# EAGLE design PIRT1280A1-12-breakout (EAGLE 9.6.1)

## Sheet 1 of 2: PIRT Sensor Breakout Pins
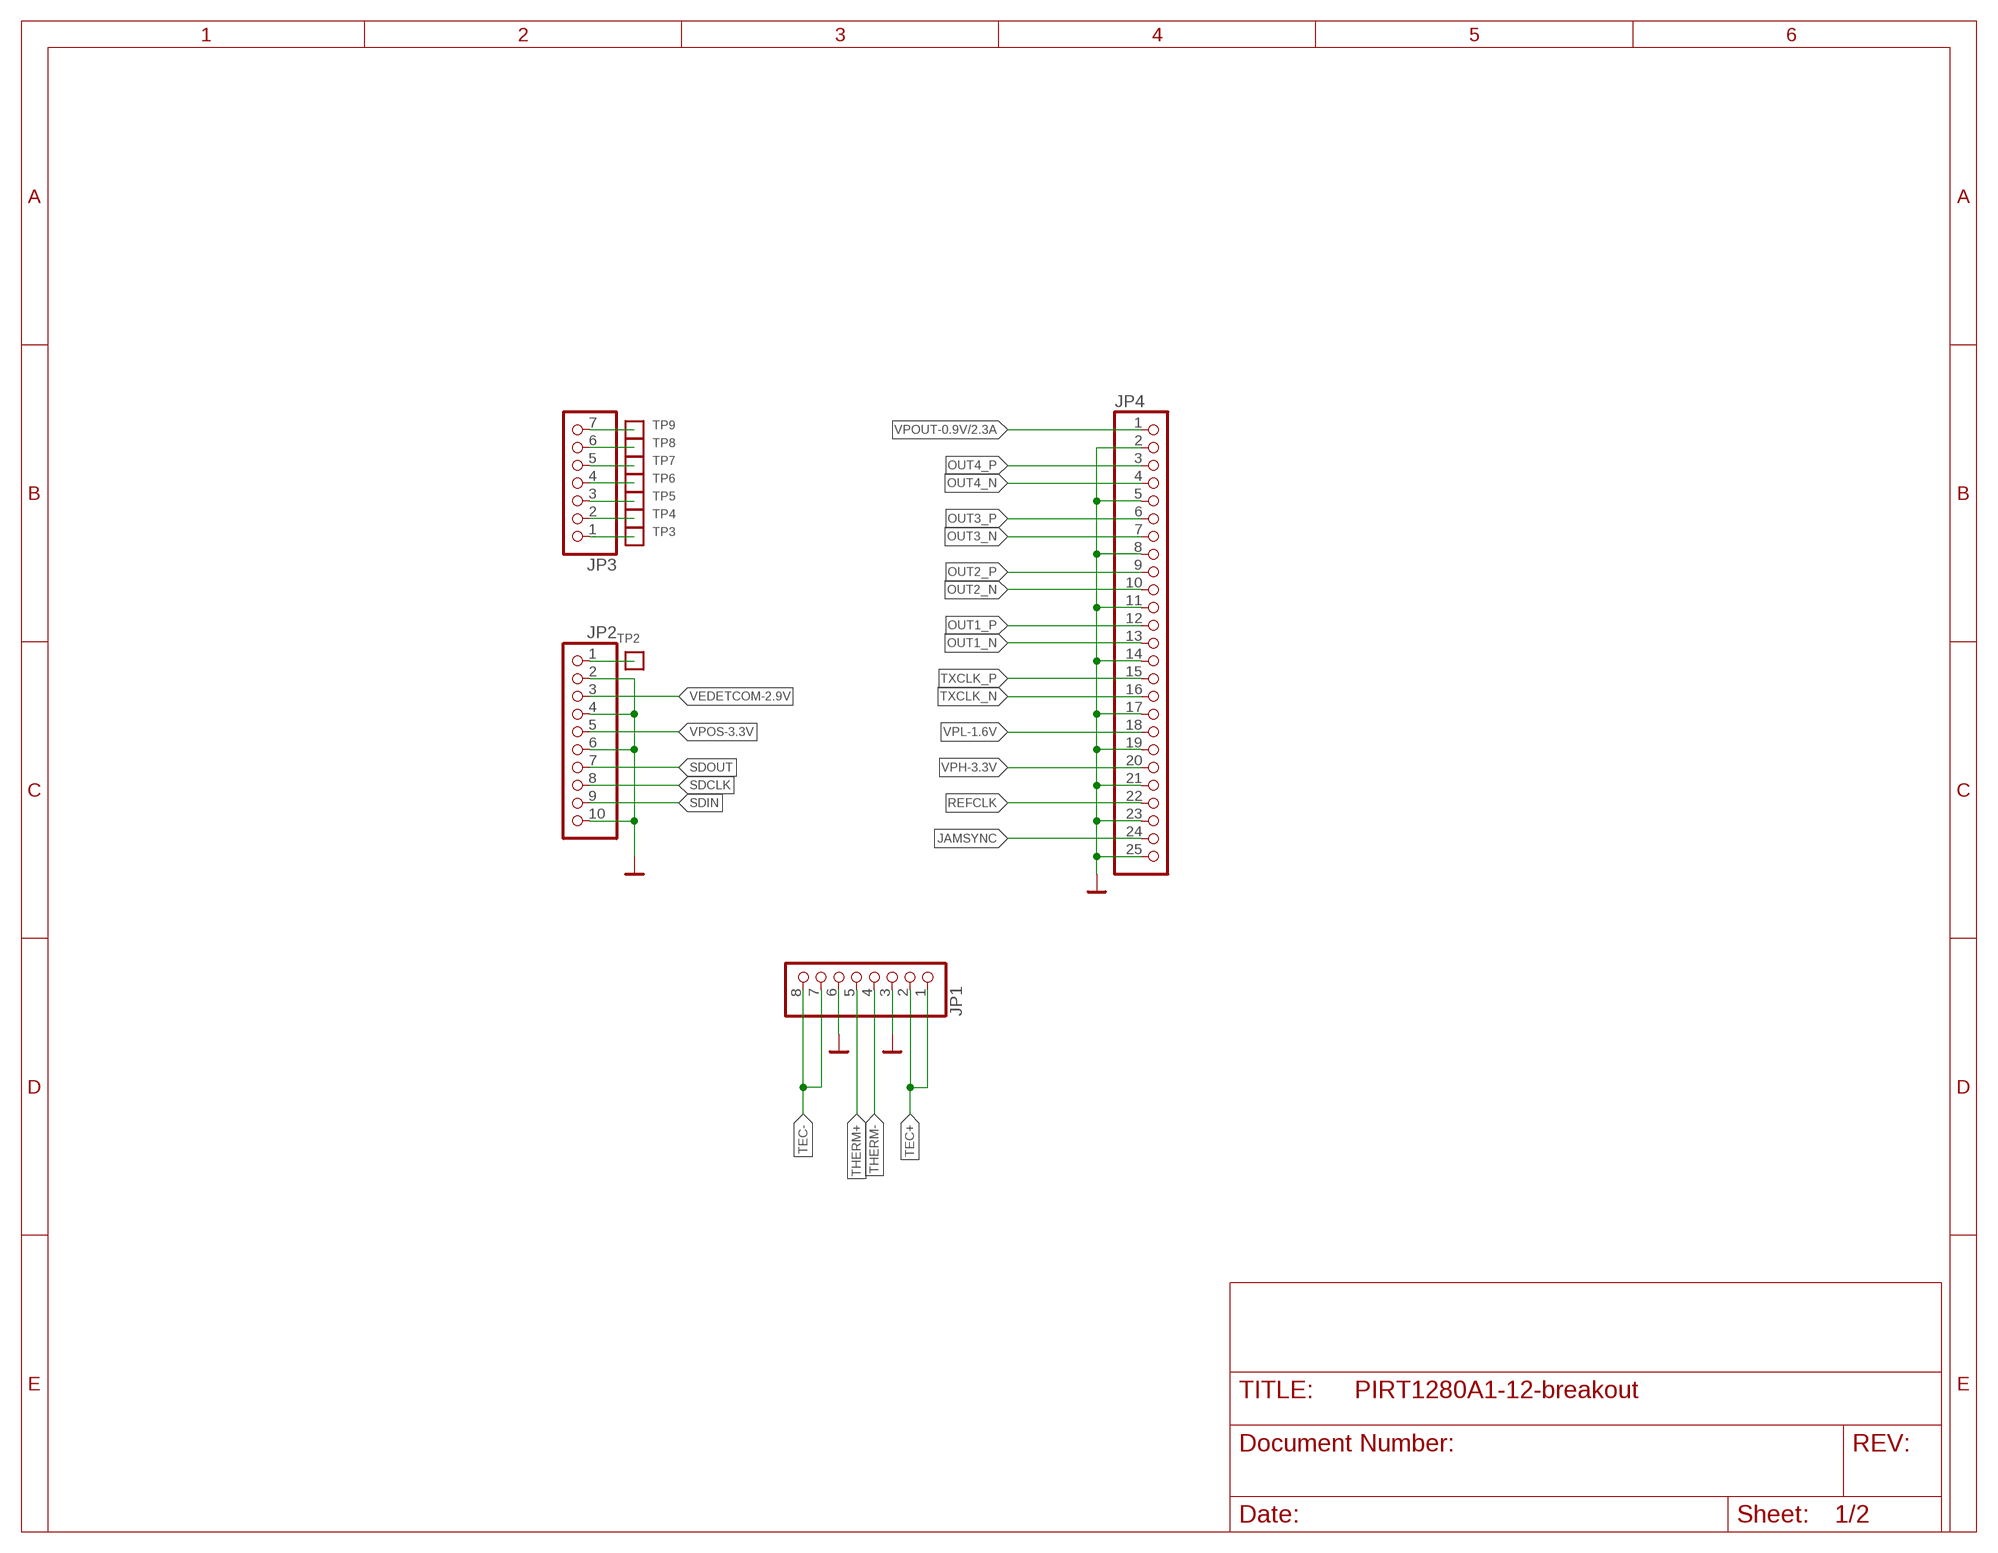
[diagram p0: schematic, sheet 1]

### Parts
JP1  PINHD-1X8  [1X08]
JP2  PINHD-1X10  [1X10]
JP3  PINHD-1X7  [1X07]
JP4  PINHD-1X25  [1X25]
TP2  TEST-POINT-LARGE-SQUARE  [1X01]
TP3  TEST-POINT-LARGE-SQUARE  [1X01]
TP4  TEST-POINT-LARGE-SQUARE  [1X01]
TP5  TEST-POINT-LARGE-SQUARE  [1X01]
TP6  TEST-POINT-LARGE-SQUARE  [1X01]
TP7  TEST-POINT-LARGE-SQUARE  [1X01]
TP8  TEST-POINT-LARGE-SQUARE  [1X01]
TP9  TEST-POINT-LARGE-SQUARE  [1X01]

### Nets
GND: JP1.3 JP1.6 JP2.2 JP2.4 JP2.6 JP2.10 JP4.2 JP4.5 JP4.8 JP4.11 JP4.14 JP4.17 JP4.19 JP4.21 JP4.23 JP4.25 ; also sheet 2
JAMSYNC: JP4.24
N$1: JP2.1 TP2.1
N$2: JP3.7 TP9.1
N$3: JP3.6 TP8.1
N$4: JP3.5 TP7.1
N$5: JP3.4 TP6.1
N$6: JP3.3 TP5.1
N$7: JP3.2 TP4.1
N$8: JP3.1 TP3.1
OUT1_N [diff-pair]: JP4.13
OUT1_P [diff-pair]: JP4.12
OUT2_N [diff-pair]: JP4.10
OUT2_P [diff-pair]: JP4.9
OUT3_N [diff-pair]: JP4.7
OUT3_P [diff-pair]: JP4.6
OUT4_N [diff-pair]: JP4.4
OUT4_P [diff-pair]: JP4.3
REFCLK: JP4.22
SDCLK: JP2.8
SDIN: JP2.9
SDOUT: JP2.7
TEC+: JP1.1 JP1.2
TEC-: JP1.7 JP1.8
THERM+: JP1.5
THERM-: JP1.4
TXCLK_N [diff-pair]: JP4.16
TXCLK_P [diff-pair]: JP4.15
VEDETCOM-2.9V: JP2.3
VPH-3.3V: JP4.20
VPL-1.6V: JP4.18
VPOS-3.3V: JP2.5
VPOUT-0.9V: JP4.1 ; also sheet 2

## Sheet 2 of 2: Power Supply
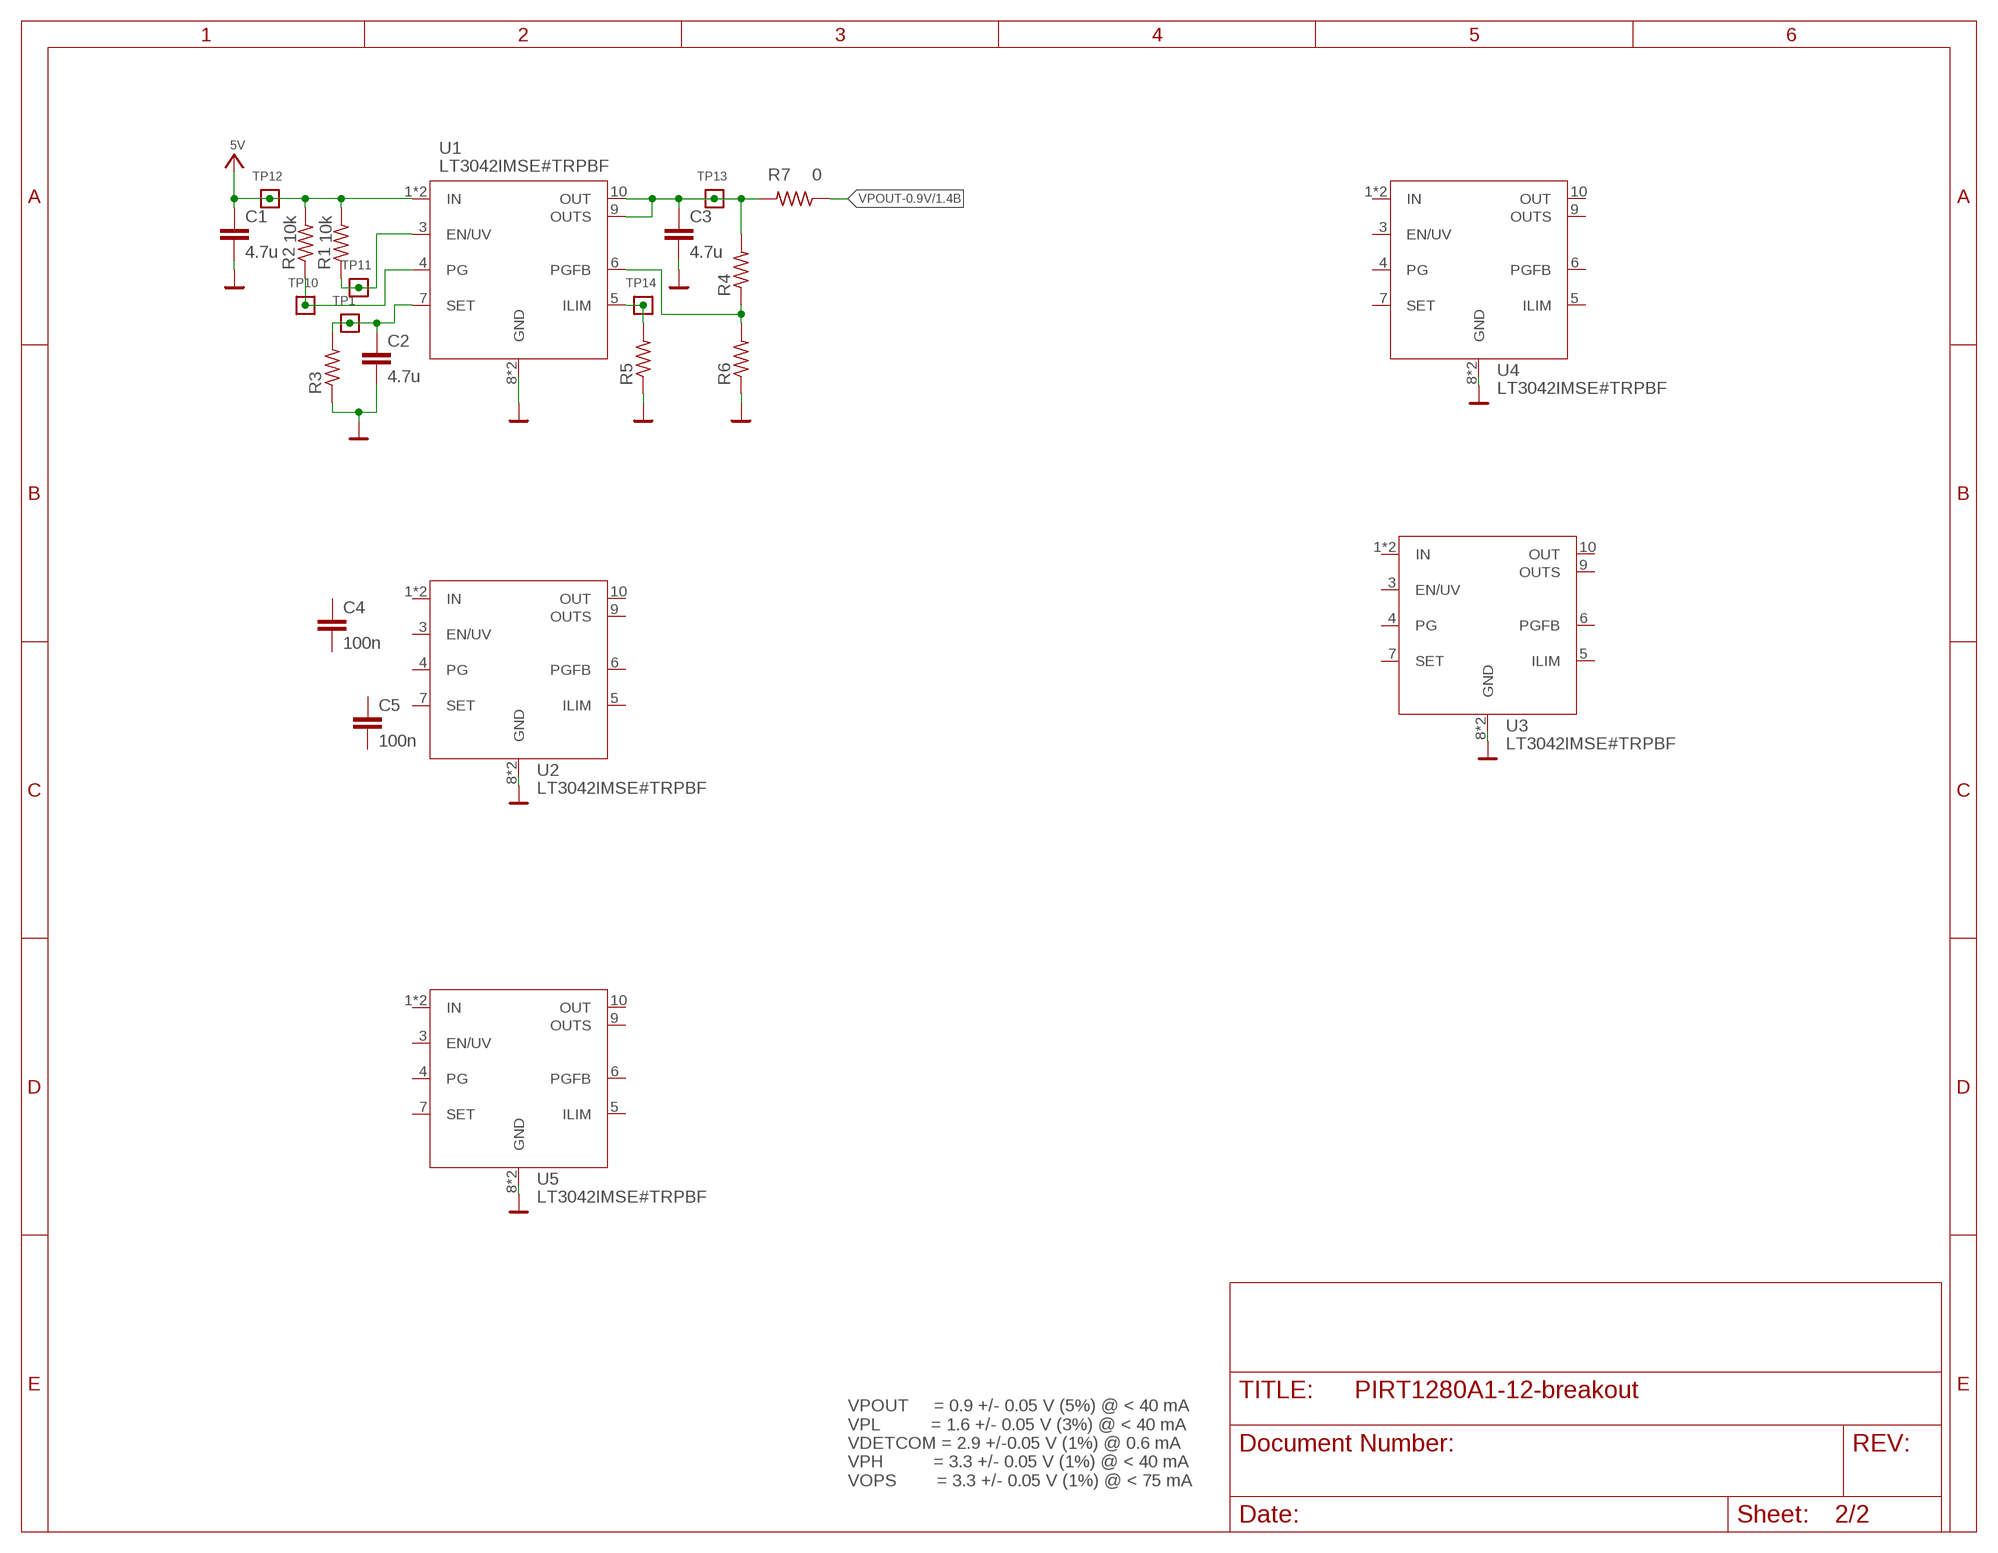
[diagram p1: schematic, sheet 2]

### Parts
C1  4.7u  C-EU0603-C-NOSILK  [.0603-C-NOSILK]
C2  4.7u  C-EU0603-C-NOSILK  [.0603-C-NOSILK]
C3  4.7u  C-EU0603-C-NOSILK  [.0603-C-NOSILK]
C4  100n  C-EU0603-C-NOSILK  [.0603-C-NOSILK]
C5  100n  C-EU0603-C-NOSILK  [.0603-C-NOSILK]
R1  10k  R-US_0603-C-NOSILK  [.0603-C-NOSILK]
R2  10k  R-US_0603-C-NOSILK  [.0603-C-NOSILK]
R3  R-US_0603-C-NOSILK  [.0603-C-NOSILK]
R4  R-US_0603-C-NOSILK  [.0603-C-NOSILK]
R5  R-US_0603-C-NOSILK  [.0603-C-NOSILK]
R6  R-US_0603-C-NOSILK  [.0603-C-NOSILK]
R7  0  R-US_0603-C-NOSILK  [.0603-C-NOSILK]
TP1  TEST-POINT-LARGE-SQUARE  [1X01]
TP10  TEST-POINT-LARGE-SQUARE  [1X01]
TP11  TEST-POINT-LARGE-SQUARE  [1X01]
TP12  TEST-POINT-LARGE-SQUARE  [1X01]
TP13  TEST-POINT-LARGE-SQUARE  [1X01]
TP14  TEST-POINT-LARGE-SQUARE  [1X01]
U1  LT3042IMSE#TRPBF  [SOP50P490X110-11N]
U2  LT3042IMSE#TRPBF  [SOP50P490X110-11N]
U3  LT3042IMSE#TRPBF  [SOP50P490X110-11N]
U4  LT3042IMSE#TRPBF  [SOP50P490X110-11N]
U5  LT3042IMSE#TRPBF  [SOP50P490X110-11N]

### Nets
5V: C1.1 R1.2 R2.2 TP12.1 U1.1(IN) U1.2(IN)
GND: C1.2 C2.2 C3.2 R3.1 R5.1 R6.1 U1.8(GND) U1.11(GND) U2.8(GND) U2.11(GND) U3.8(GND) U3.11(GND) U4.8(GND) U4.11(GND) U5.8(GND) U5.11(GND) ; also sheet 1
N$9: R1.1 TP11.1 U1.3(EN/UV)
N$10: C2.1 R3.2 TP1.1 U1.7(SET)
N$11: R2.1 TP10.1 U1.4(PG)
N$12: R5.2 TP14.1 U1.5(ILIM)
N$15: R4.1 R6.2 U1.6(PGFB)
VPOUT: C3.1 R4.2 R7.2 TP13.1 U1.9(OUTS) U1.10(OUT)
VPOUT-0.9V: R7.1 ; also sheet 1
Unconnected: C4.1 C4.2 C5.1 C5.2 U2.3(EN/UV) U2.4(PG) U2.5(ILIM) U2.6(PGFB) U2.7(SET) U3.3(EN/UV) U3.4(PG) U3.5(ILIM) U3.6(PGFB) U3.7(SET) U4.3(EN/UV) U4.4(PG) U4.5(ILIM) U4.6(PGFB) U4.7(SET) U5.3(EN/UV) U5.4(PG) U5.5(ILIM) U5.6(PGFB) U5.7(SET)

### Notes on the sheet
- VPOUT     = 0.9 +/- 0.05 V (5%) @ < 40 mA
  VPL          = 1.6 +/- 0.05 V (3%) @ < 40 mA 
  VDETCOM = 2.9 +/-0.05 V (1%) @ 0.6 mA
  VPH          = 3.3 +/- 0.05 V (1%) @ < 40 mA
  VOPS        = 3.3 +/- 0.05 V (1%) @ < 75 mA

## Power pins joined to a net without a drawn wire
IN: U2.1(IN) U2.2(IN) U3.1(IN) U3.2(IN) U4.1(IN) U4.2(IN) U5.1(IN) U5.2(IN)
OUT: U2.10(OUT) U3.10(OUT) U4.10(OUT) U5.10(OUT)
OUTS: U2.9(OUTS) U3.9(OUTS) U4.9(OUTS) U5.9(OUTS)

## Library data of the parts
C1-C5 = oresat-rcl:C-EU: CAPACITOR, European symbol
JP1 = pinhead:PINHD-1X8: PIN HEADER
JP2 = pinhead:PINHD-1X10: PIN HEADER
JP3 = pinhead:PINHD-1X7: PIN HEADER
JP4 = pinhead:PINHD-1X25: PIN HEADER
R1-R7 = oresat-rcl:R-US_: RESISTOR, American symbol
TP1-TP14 = oresat-misc:TEST-POINT-LARGE-SQUARE
U1-U5 = U-Analog-LT3042-ultralow-noise-ldo:LT3042IMSE#TRPBF: Ldo, Adj, 0.2a, 0v-15v, Msop-10; DESCRIPTION: LDO Regulator Pos 0V to 15V 0.2A Automotive Medical 10-Pin MSOP EP T/R; DIGI-KEY_PART_NUMBER: LT3042IMSE#TRPBFCT-ND; MF: Analog Devices; MP: LT3042IMSE#TRPBF; PACKAGE: MSOP -10 Analog Devices; PURCHASE-URL: https://pricing.snapeda.com/search/part/LT3042IMSE#TRPBF/?ref=eda

## Net classes
1 diff-pair: width 0.381 mm, clearance 0.508 mm to class 0, clearance 0.254 mm

## Board
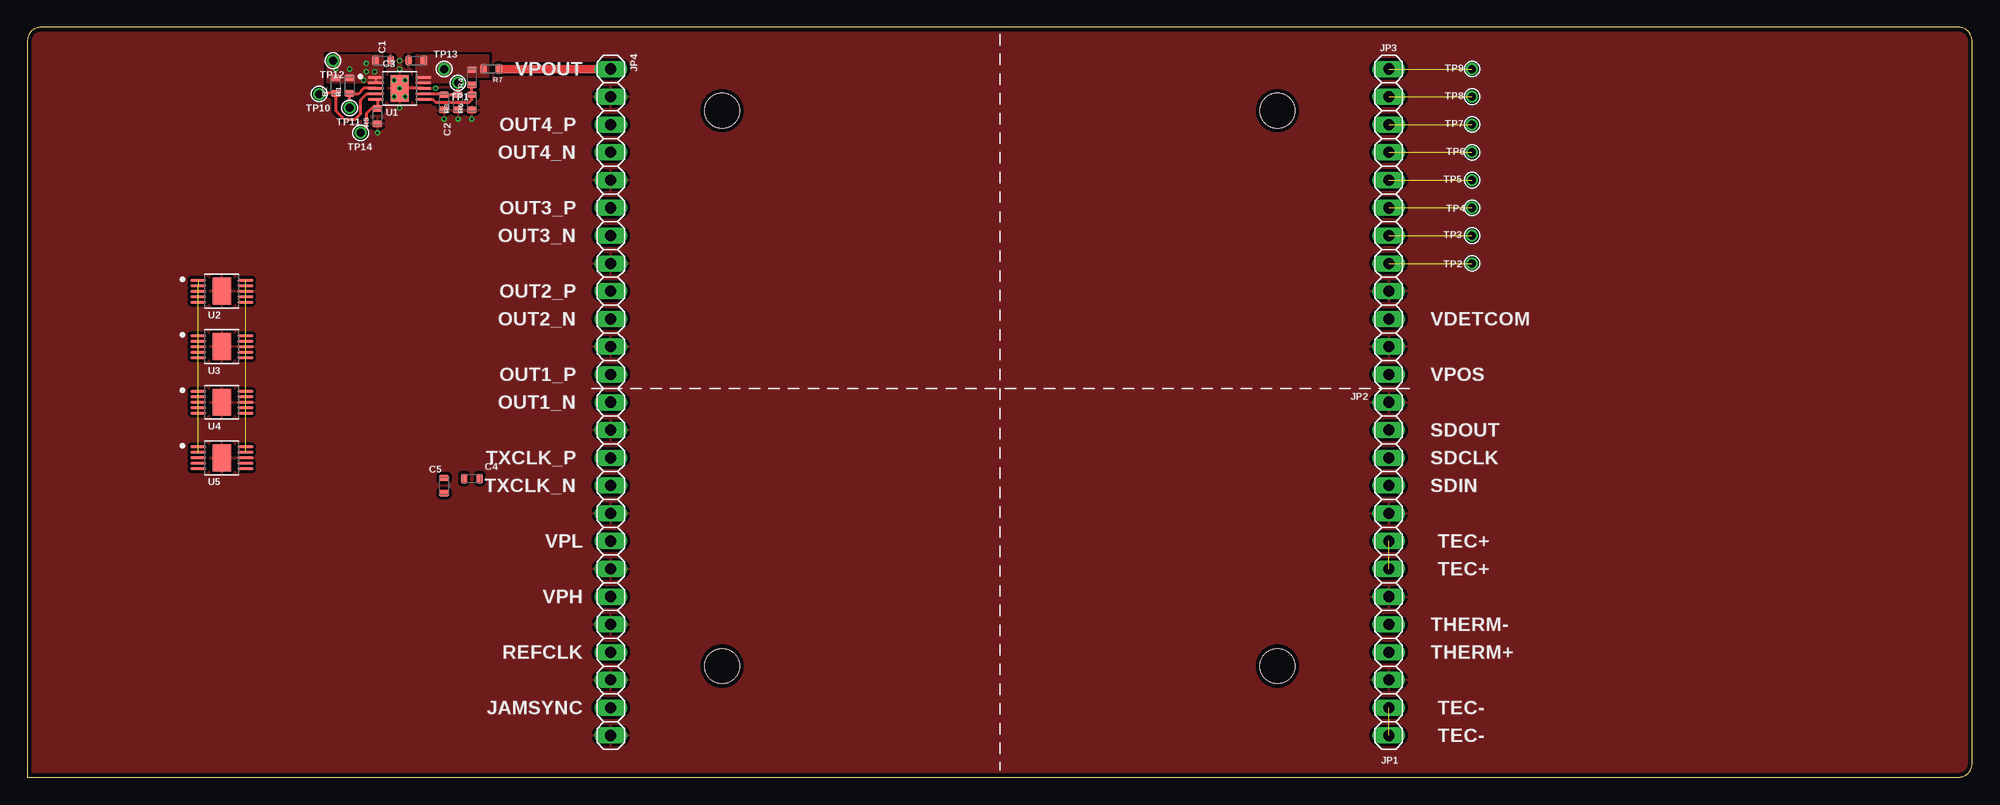
[diagram p2: board, top side]
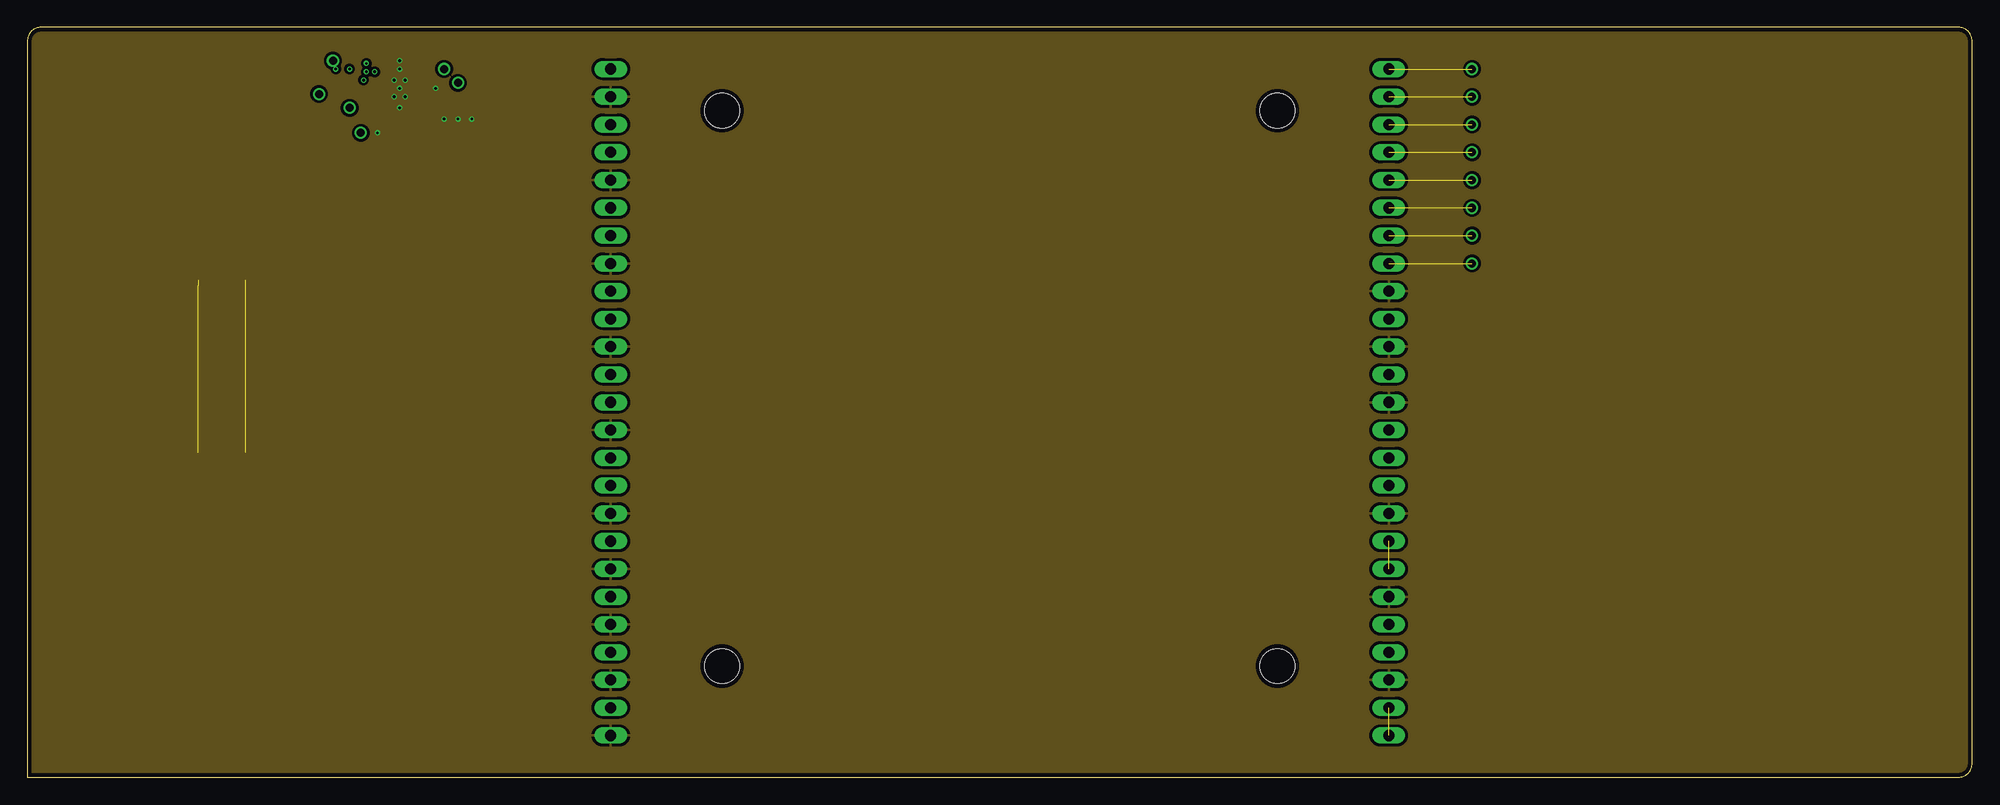
[diagram p3: board, inner layer Route2]
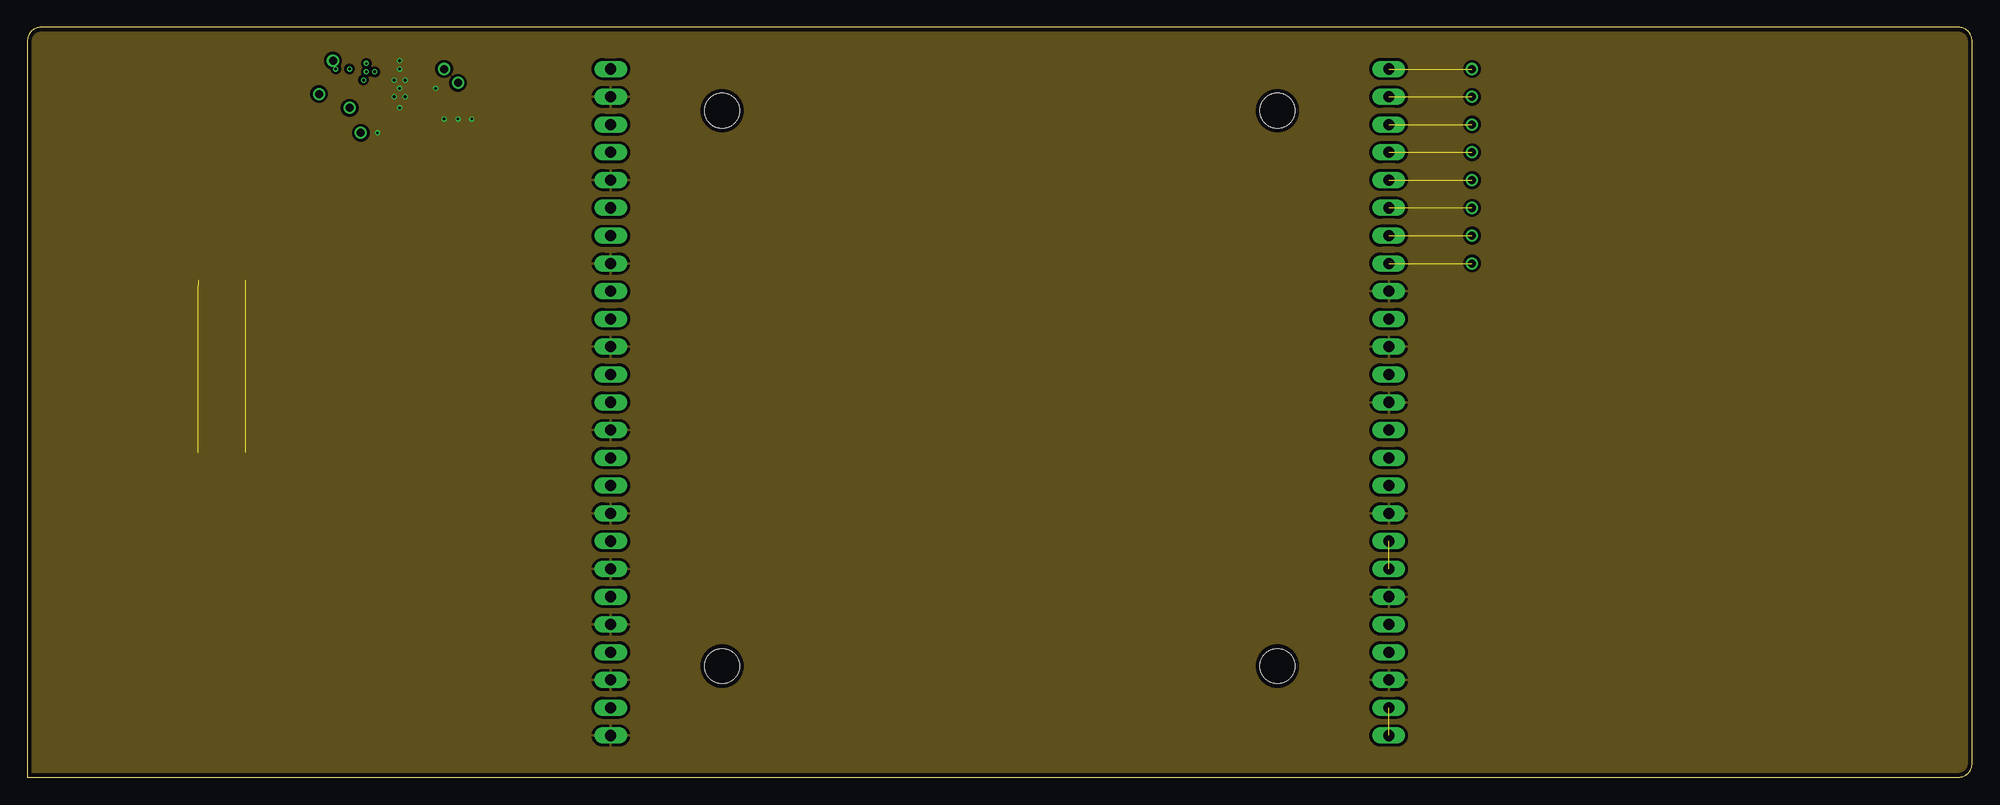
[diagram p4: board, inner layer Route15]
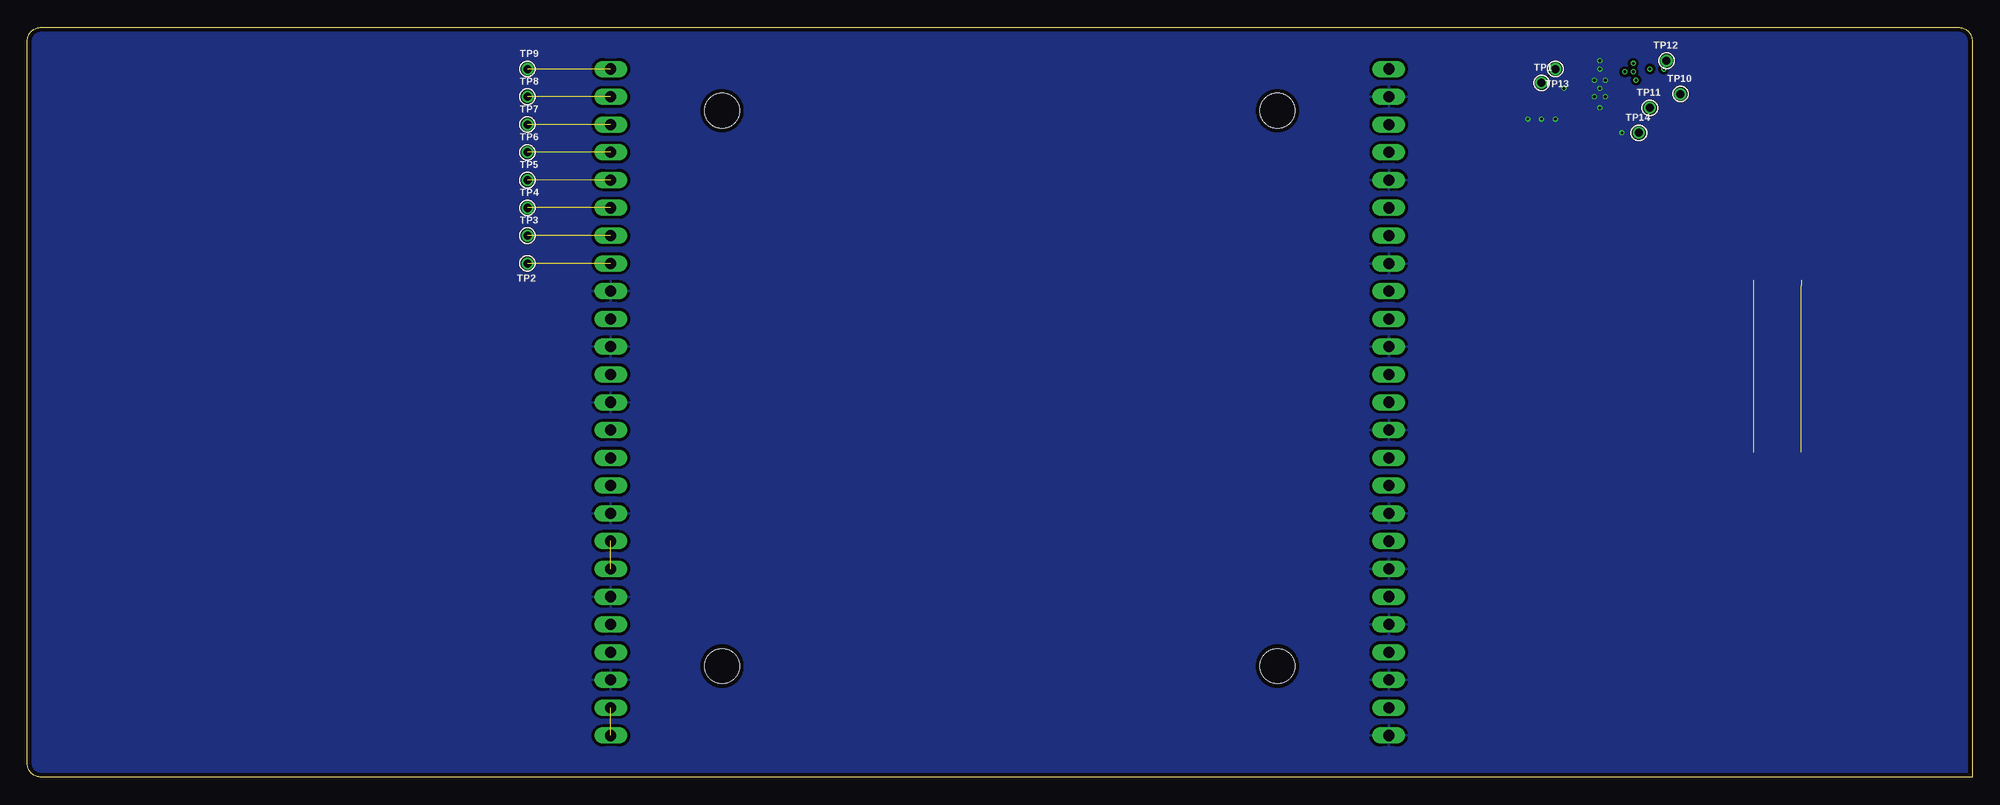
[diagram p5: board, bottom side, seen from below]

Size 177.8 x 68.58 mm. Coordinates in mm from the lower left corner, seen from the top.
Outline: 0,0 176.53,0 arc90 177.8,1.27 177.8,67.31 arc90 176.53,68.58 1.27,68.58 arc90 0,67.31 0,0
Copper layers (1*2*15*16): Top 0.035559375mm / dielectric 0.17018125mm / Route2 0.01778125mm / dielectric 47mil / Route15 0.01778125mm / dielectric 0.17018125mm / Bottom 0.035559375mm
Design rules "oshpark-4layer-tented": minimum track width 5mil, minimum drill 10mil, track to track 5mil, track to pad 5mil, pad to pad 5mil, via to via 5mil, smd to smd 5mil, copper to edge 15mil, drill to drill 6mil, minimum pad ring 4mil, minimum via ring 4mil, stop-mask expansion 2.5mil, vias tented up to drill 20mil, thermal gap 10mil
Holes 3.17 mm at 63.5,10.16 63.5,60.96 114.3,60.96 114.3,10.16

### Footprints (pad centres in the part's own frame; a part is rotated, then mirrored left to right if it is on the bottom)
.0603-C-NOSILK = smd 0.6 x 0.9: 1 -0.7,0; 2 0.7,0
1X08 = drill 1.016 long: 1 -8.89,0; 2 -6.35,0; 3 -3.81,0; 4 -1.27,0; 5 1.27,0; 6 3.81,0; 7 6.35,0; 8 8.89,0
1X10 = drill 1.016 long: 1 -11.43,0; 2 -8.89,0; 3 -6.35,0; 4 -3.81,0; 5 -1.27,0; 6 1.27,0; 7 3.81,0; 8 6.35,0; 9 8.89,0; 10 11.43,0
1X07 = drill 1.016 long: 1 -7.62,0; 2 -5.08,0; 3 -2.54,0; 4 0,0; 5 2.54,0; 6 5.08,0; 7 7.62,0
1X25 = drill 1.016 long: 1 -29.21,0; 2 -26.67,0; 3 -24.13,0; 4 -21.59,0; 5 -19.05,0; 6 -16.51,0; 7 -13.97,0; 8 -11.43,0; 9 -8.89,0; 10 -6.35,0; 11 -3.81,0; 12 -1.27,0; 13 1.27,0; 14 3.81,0; 15 6.35,0; 16 8.89,0; 17 11.43,0; 18 13.97,0; 19 16.51,0; 20 19.05,0; 21 21.59,0; 22 24.13,0; 23 26.67,0; 24 29.21,0; 25 31.75,0
1X01 = drill 0.737 pad 1.1: 1 0,0
SOP50P490X110-11N = smd 1.45 x 0.28: 1 -2.16,1; 2 -2.16,0.5; 3 -2.16,0; 4 -2.16,-0.5; 5 -2.16,-1; 6 2.16,-1; 7 2.16,-0.5; 8 2.16,0; 9 2.16,0.5; 10 2.16,1 | smd 1.68 x 2.46: 11 0,0

### Placement (x,y rotation side)
C1  32.51,65.53 0 top
C2  38.1,61.72 270 top
C3  35.56,65.53 180 top
C4  40.64,27.3 180 top
C5  38.1,26.67 90 top
JP1  124.46,12.7 270 top
JP2  124.46,35.56 270 top
JP3  124.46,57.15 90 top
JP4  53.34,35.56 270 top
R1  29.46,63.25 90 top
R2  28.19,63.25 90 top
R3  39.37,61.72 90 top
R4  40.64,64.01 90 top
R5  32,60.45 90 top
R6  40.64,61.72 90 top
R7  42.42,64.77 180 top
TP1  39.37,63.5 180 top
TP2  132.08,46.99 0 top
TP3  132.08,49.53 180 top
TP4  132.08,52.07 180 top
TP5  132.08,54.61 180 top
TP6  132.08,57.15 180 top
TP7  132.08,59.69 180 top
TP8  132.08,62.23 180 top
TP9  132.08,64.77 180 top
TP10  26.67,62.48 180 top
TP11  29.46,61.21 180 top
TP12  27.94,65.53 180 top
TP13  38.1,64.77 0 top
TP14  30.48,58.93 180 top
U1  34.04,62.99 0 top
U2  17.78,44.45 0 top
U3  17.78,39.37 0 top
U4  17.78,34.29 0 top
U5  17.78,29.21 0 top

### Tracks (layer width: path | path; a pad name or v marks a point on that pad's centre or on a via)
5V  (via drill 0.25)
  Top 0.254: U1.2 U1.1
  other vias: 28.19,64.77 29.46,64.77 30.99,65.28 31.75,64.52 30.73,63.75 30.99,64.52
  pour Top (isolate 0.254, no thermals): 32.51,63.5 32.51,66.04 27.43,66.04 27.43,63.5
GND  (via drill 0.25)
  Top 0.254: U1.8 U1.11
  other vias: 33.53,63.75 34.54,63.75 34.04,62.99 33.53,62.23 34.54,62.23 32,58.93 39.37,60.2 40.64,60.2 38.1,60.2 34.04,61.21 34.04,65.53 34.04,64.77 37.34,62.99
  pour Top (isolate 0.254, rank 6): 176.53,0 1.27,0 arc-90 0,1.27 0,67.31 arc-90 1.27,68.58 176.53,68.58 arc-90 177.8,67.31 177.8,1.27 arc-90
  pour Bottom (isolate 0.254, rank 6): 176.53,0 1.27,0 arc-90 0,1.27 0,67.31 arc-90 1.27,68.58 176.53,68.58 arc-90 177.8,67.31 177.8,1.27 arc-90
  pour Route2 (isolate 0.254, rank 6): 176.53,0 1.27,0 arc-90 0,1.27 0,67.31 arc-90 1.27,68.58 176.53,68.58 arc-90 177.8,67.31 177.8,1.27 arc-90
  pour Route15 (isolate 0.254, rank 6): 176.53,0 1.27,0 arc-90 0,1.27 0,67.31 arc-90 1.27,68.58 176.53,68.58 arc-90 177.8,67.31 177.8,1.27 arc-90
IN  (7 unrouted)
N$1  (1 unrouted)
N$2  (1 unrouted)
N$3  (1 unrouted)
N$4  (1 unrouted)
N$5  (1 unrouted)
N$6  (1 unrouted)
N$7  (1 unrouted)
N$8  (1 unrouted)
N$9
  Top 0.254: U1.3 30.73,62.99 30.23,62.48 29.53,62.48 | 29.53,62.48 R1.1 | TP11.1 29.46,62.42 29.53,62.48
N$10
  Top 0.254: U1.7 38.03,62.49 C2.1 R3.2 TP1.1
N$11
  Top 0.254: U1.4 31.03,62.49 30.48,61.95 30.48,60.71 29.97,60.2 28.96,60.2 28.19,60.96 R2.1 26.73,62.55 TP10.1
N$12
  Top 0.254: U1.5 32,61.86 R5.2 31.43,61.15 30.99,60.71 30.99,59.44 TP14.1
N$15
  Top 0.254: U1.6 37.07,61.99 37.34,61.72 40.39,61.72 40.64,61.98 R6.2 R4.1
OUT  (3 unrouted)
OUTS  (3 unrouted)
TEC+  (1 unrouted)
TEC-  (1 unrouted)
VPOUT
  Top 0.508: 40.7,64.77 R4.2
  pour Top (isolate 0.254, no thermals): 42.16,66.04 42.16,64.01 38.86,64.01 38.86,63.5 35.56,63.5 35.56,66.04
VPOUT-0.9V
  Top 0.508: 43.43,64.77 R7.1
  Top 0.762: JP4.1 43.43,64.77

### Text on the board
tPlace: OreSat PIRT1280A1-12 Carrier Board | v1 | 2021-01-21 | VPOUT | OUT4_P | OUT4_N | OUT3_P | OUT3_N | OUT2_P | OUT2_N | VDETCOM | OUT1_P | VPOS | OUT1_N | SDOUT | TXCLK_P | SDCLK | TXCLK_N | SDIN | VPL | TEC+ | TEC+ | VPH | THERM- | REFCLK | THERM+ | JAMSYNC | TEC- | TEC-